# Altium project 4Z_PCB_2.PrjPcb
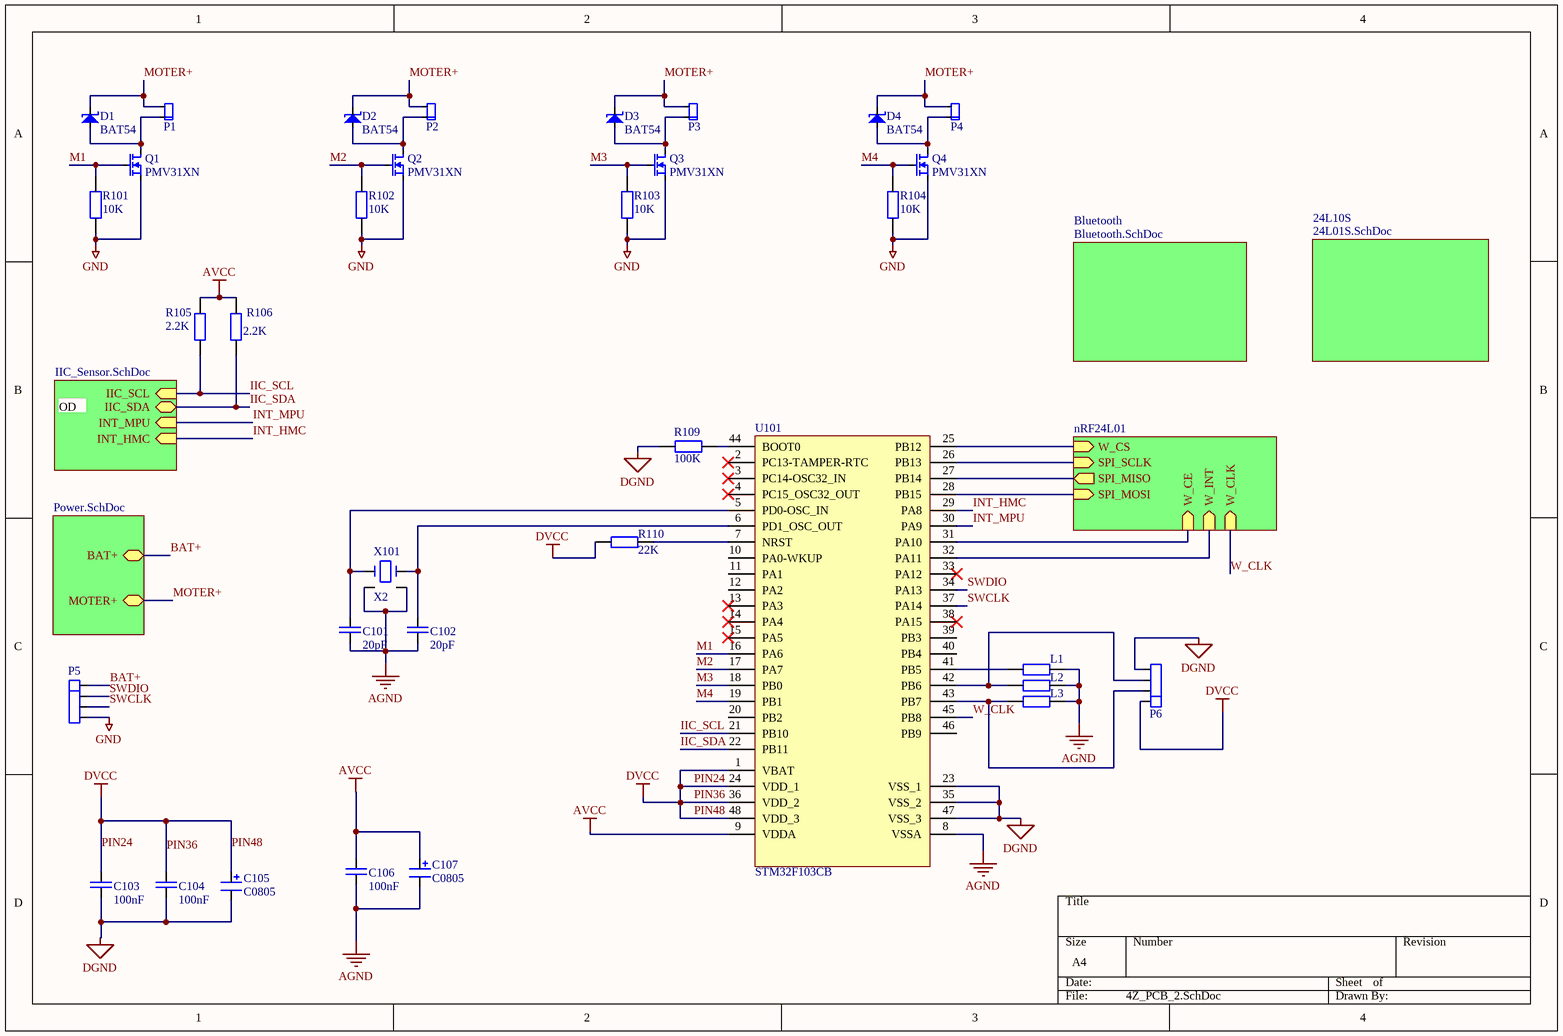
[diagram p0: 4Z_PCB_2.SchDoc]
3 sheets, 69 parts. Net scope: hierarchical (ports join the sheet entries above them; power ports are global).
Board file: 4Z_PCB_2.PcbDoc
Sheets:
  4Z_PCB_2.SchDoc
    Bluetooth = Bluetooth.SchDoc
    24L10S = 24L01S.SchDoc

## Sheet 4Z_PCB_2.SchDoc
size A4

### Parts
C101  20pF  [0603]
C102  20pF  [0603]
C103  100nF  [0603]
C104  100nF  [0603]
C105  C0805  [0805]
C106  100nF  [0603]
C107  C0805  [0805]
D1  BAT54  [BAT54]
D2  BAT54  [BAT54]
D3  BAT54  [BAT54]
D4  BAT54  [BAT54]
L1  (no value)  [0603]
L2  (no value)  [0603]
L3  (no value)  [0603]
P1  DIP_2  [DIP_2]  (value not drawn)
P2  DIP_2  [DIP_2]  (value not drawn)
P3  DIP_2  [DIP_2]  (value not drawn)
P4  DIP_2  [DIP_2]  (value not drawn)
P5  DIP_4  [DIP_4]  (value not drawn)
P6  (no value)  [DIP_4]
Q1  PMV31XN  [SOT23-TO236AB]
Q2  PMV31XN  [SOT23-TO236AB]
Q3  PMV31XN  [SOT23-TO236AB]
Q4  PMV31XN  [SOT23-TO236AB]
R101  10K  [0603]
R102  10K  [0603]
R103  10K  [0603]
R104  10K  [0603]
R105  2.2K  [0603]
R106  2.2K  [0603]
R109  100K  [0603]
R110  22K  [0603]
U101  STM32F103CB  [LQFP48]
X101  X2  [3225]

### Sub-sheets
24L10S = 24L01S.SchDoc: no entries
Bluetooth = Bluetooth.SchDoc: no entries
IIC_Sensor = IIC_Sensor.SchDoc (file not in this document): IIC_SCL (in), IIC_SDA (bidir), INT_MPU (in), INT_HMC (in)
nRF24L01 = nRF24L01 (file not in this document): W_CE (in), W_CS (in), W_CLK (in), SPI_SCLK (in), SPI_MOSI (in), SPI_MISO (out), W_INT (in)
Power = Power.SchDoc (file not in this document): BAT+, MOTER+

### Nets
AGND: C101.1 C102.1 C106.1 C107.2 L1.1 L2.1 L3.1 U101.8(VSSA) X101.2 X101.4
AVCC: C106.2 C107.1 R105.1 R106.1 U101.9(VDDA)
DGND: C103.1 C104.1 C105.2 P6.4 R109.2 U101.23(VSS_1) U101.35(VSS_2) U101.47(VSS_3)
GND: P5.4 Q1.2 Q2.2 Q3.2 Q4.2 R101.2 R102.2 R103.2 R104.2
PIN24: C103.2 C104.2 C105.1 P6.1 R110.2 U101.1(VBAT) U101.24(VDD_1) U101.36(VDD_2) U101.48(VDD_3)  [also labelled DVCC, PIN36, PIN48]
BAT+: P5.1 ; sheet Power/BAT+
IIC_SCL: R105.2 U101.21(PB10) ; sheet IIC_Sensor/IIC_SCL
IIC_SDA: R106.2 U101.22(PB11) ; sheet IIC_Sensor/IIC_SDA
INT_HMC: U101.29(PA8) ; sheet IIC_Sensor/INT_HMC
INT_MPU: U101.30(PA9) ; sheet IIC_Sensor/INT_MPU
M1: Q1.1 R101.1 U101.16(PA6)
M2: Q2.1 R102.1 U101.17(PA7)
M3: Q3.1 R103.1 U101.18(PB0)
M4: Q4.1 R104.1 U101.19(PB1)
MOTER+: D1.3 D2.3 D3.3 D4.3 P1.2 P2.2 P3.2 P4.2 ; sheet Power/MOTER+
SWCLK: P5.3 U101.37(PA14)
SWDIO: P5.2 U101.34(PA13)
W_CLK: U101.45(PB8) ; sheet nRF24L01/W_CLK
NetC101_2: C101.2 U101.5(PD0-OSC_IN) X101.1
NetC102_2: C102.2 U101.6(PD1_OSC_OUT) X101.3
NetD1_1: D1.1 P1.1 Q1.3
NetD2_1: D2.1 P2.1 Q2.3
NetD3_1: D3.1 P3.1 Q3.3
NetD4_1: D4.1 P4.1 Q4.3
NetL1_2: L1.2 U101.41(PB5)
NetL2_2: L2.2 P6.3 U101.42(PB6)
NetL3_2: L3.2 P6.2 U101.43(PB7)
NetR109_1: R109.1 U101.44(BOOT0)
NetR110_1: R110.1 U101.7(NRST)
NetU101_25: U101.25(PB12) ; sheet nRF24L01/W_CS
NetU101_26: U101.26(PB13) ; sheet nRF24L01/SPI_SCLK
NetU101_27: U101.27(PB14) ; sheet nRF24L01/SPI_MISO
NetU101_28: U101.28(PB15) ; sheet nRF24L01/SPI_MOSI
NetU101_31: U101.31(PA10) ; sheet nRF24L01/W_CE
NetU101_32: U101.32(PA11) ; sheet nRF24L01/W_INT

Not connected (* = marked no-connect by the designer): U101 2(PC13-TAMPER-RTC)* 3(PC14-OSC32_IN)* 4(PC15_OSC32_OUT)* 10(PA0-WKUP) 11(PA1) 12(PA2) 13(PA3)* 14(PA4)* 15(PA5)* 20(PB2) 33(PA12)* 38(PA15)* 39(PB3) 40(PB4) 46(PB9)

### Notes on the sheet
- OD

### Library data of the parts
C101-C104 C106 = C0603
L1-L3 R101-R106 R109 R110 = R0603
P6 = DIP_4
X101 = X2: 3225

## Sheet Bluetooth.SchDoc
size A4
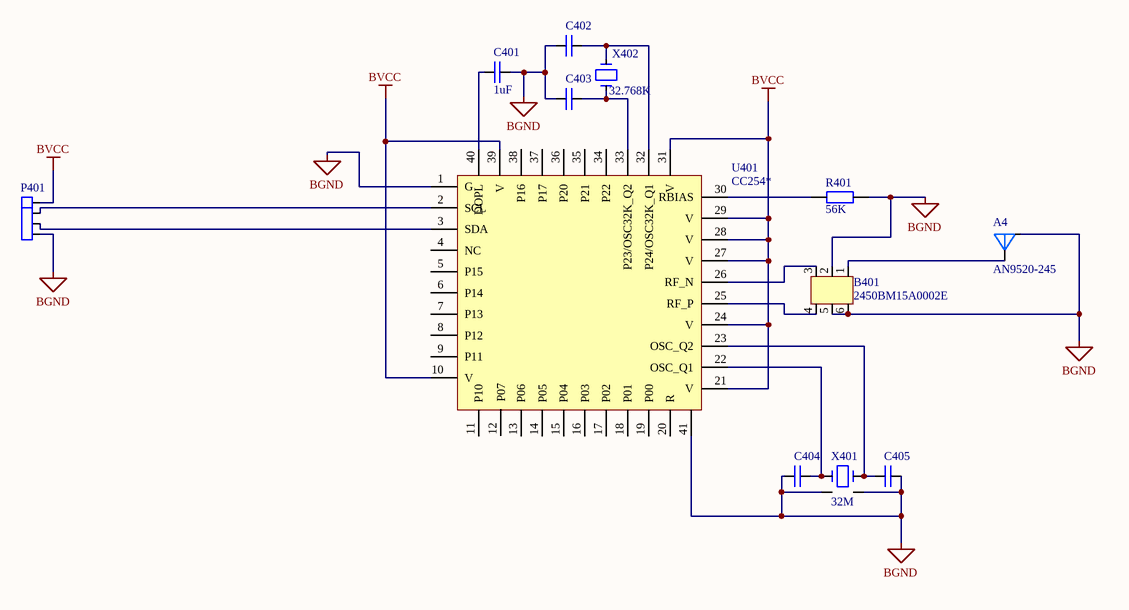
[diagram p1: Bluetooth.SchDoc]

### Parts
A4  AN9520-245  [AN9520-245]
B401  2450BM15A0002E  [2450BM15A0002]
C401  1uF  [0603]
C402  (no value)  [0603]
C403  (no value)  [0603]
C404  (no value)  [0603]
C405  (no value)  [0603]
P401  DIP_4  [DIP_4]  (value not drawn)
R401  56K  [0603]
U401  CC254*  [CC254x]
X401  32M  [3225]
X402  32.768K  [3215]

### Nets
BGND: A4.2 B401.2 B401.5 B401.6 C401.2 C402.1 C403.1 C404.1 C405.2 P401.4 R401.1 U401.1(G) U401.41 X401.2 X401.4
BVCC: P401.1 U401.10(V) U401.21(V) U401.24(V) U401.27(V) U401.28(V) U401.29(V) U401.31(V) U401.39(V)
NetA4_1: A4.1 B401.1
NetB401_3: B401.3 U401.26(RF_N)
NetB401_4: B401.4 U401.25(RF_P)
NetC401_1: C401.1 U401.40(DOPL)
NetC402_2: C402.2 U401.32(P24/OSC32K_Q1) X402.2
NetC403_2: C403.2 U401.33(P23/OSC32K_Q2) X402.1
NetC404_2: C404.2 U401.22(OSC_Q1) X401.1
NetC405_1: C405.1 U401.23(OSC_Q2) X401.3
NetP401_2: P401.2 U401.2(SCL)
NetP401_3: P401.3 U401.3(SDA)
NetR401_2: R401.2 U401.30(RBIAS)

Not connected (* = marked no-connect by the designer): U401 4(NC) 5(P15) 6(P14) 7(P13) 8(P12) 9(P11) 11(P10) 12(P07) 13(P06) 14(P05) 15(P04) 16(P03) 17(P02) 18(P01) 19(P00) 20(R) 34(P22) 35(P21) 36(P20) 37(P17) 38(P16)

### Library data of the parts
A4 = AN9520-245: antenna
B401 = 2450BM15A0002E: CC2541
C401-C405 = C0603
R401 = R0603
U401 = CC254x
X401 = X2: 3225
X402 = X3: 3215

## Sheet 24L01S.SchDoc
size A4
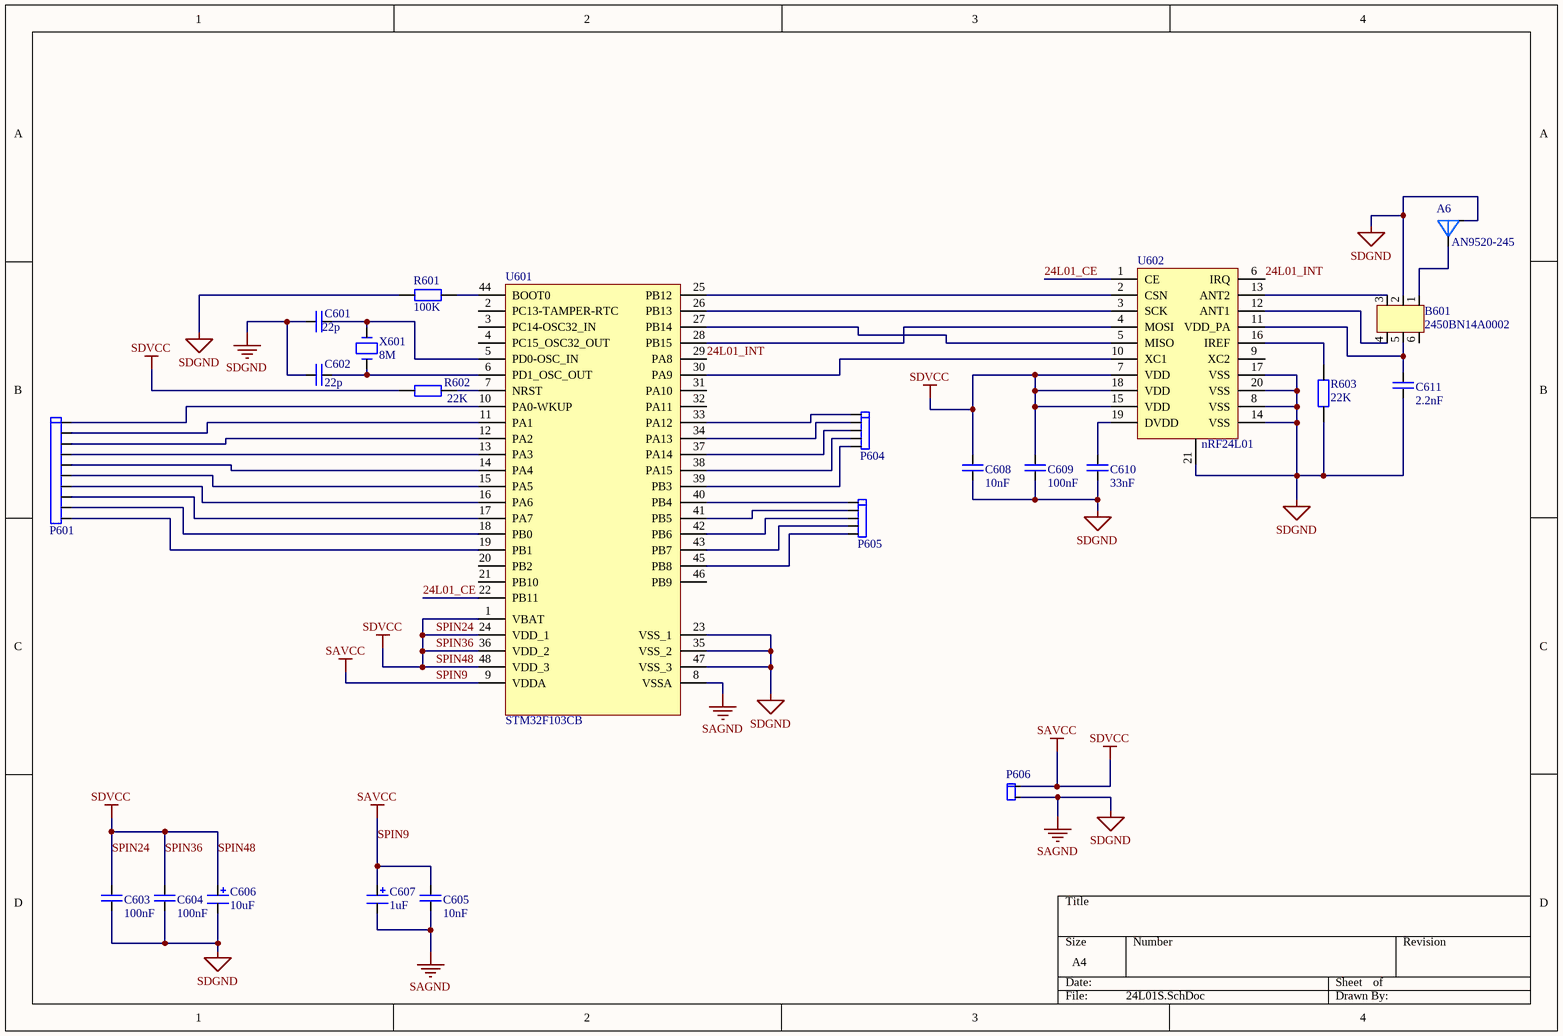
[diagram p2: 24L01S.SchDoc]

### Parts
A6  AN9520-245  [AN9520-245]
B601  2450BN14A0002  [2450BM14A0002]
C601  22p  [0603]
C602  22p  [0603]
C603  100nF  [0603]
C604  100nF  [0603]
C605  10nF  [0603]
C606  10uF  [0805]
C607  1uF  [0805]
C608  10nF  [0603]
C609  100nF  [0603]
C610  33nF  [0603]
C611  2.2nF  [0603]
P601  DIP10_1.27mm  [DIP10_1.27mm]  (value not drawn)
P604  DIP_5_1.27mm  [DIP_5_1.27mm]  (value not drawn)
P605  DIP_5_1.27mm  [DIP_5_1.27mm]  (value not drawn)
P606  DIP_2  [DIP_2]  (value not drawn)
R601  100K  [0603]
R602  22K  [0603]
R603  22K  [0603]
U601  STM32F103CB  [LQFP48]
U602  nRF24L01  [nRF24L01]
X601  8M  [X1]

### Nets
SAGND: A6.2 B601.2 C601.1 C602.1 C603.1 C604.1 C605.1 C606.2 C607.2 C608.1 C609.1 C610.1 C611.1 P606.2 R601.1 R603.2 U601.8(VSSA) U601.23(VSS_1) U601.35(VSS_2) U601.47(VSS_3) U602.8(VSS) U602.14(VSS) U602.17(VSS) U602.20(VSS) U602.21  [also labelled SDGND]
SPIN24: C603.2 C604.2 C605.2 C606.1 C607.1 C608.2 C609.2 P606.1 R602.2 U601.1(VBAT) U601.9(VDDA) U601.24(VDD_1) U601.36(VDD_2) U601.48(VDD_3) U602.7(VDD) U602.15(VDD) U602.18(VDD)  [also labelled SAVCC, SDVCC, SPIN36, SPIN48, SPIN9]
24L01_CE: U601.22(PB11) U602.1(CE)
24L01_INT: U601.29(PA8) U602.6(IRQ)
NetA6_1: A6.1 B601.1
NetB601_3: B601.3 U602.13(ANT2)
NetB601_4: B601.4 U602.12(ANT1)
NetB601_5: B601.5 C611.2 U602.11(VDD_PA)
NetC601_2: C601.2 U601.5(PD0-OSC_IN) X601.2
NetC602_2: C602.2 U601.6(PD1_OSC_OUT) X601.1
NetC610_2: C610.2 U602.19(DVDD)
NetP601_1: P601.1 U601.10(PA0-WKUP)
NetP601_2: P601.2 U601.11(PA1)
NetP601_3: P601.3 U601.12(PA2)
NetP601_4: P601.4 U601.13(PA3)
NetP601_5: P601.5 U601.14(PA4)
NetP601_6: P601.6 U601.15(PA5)
NetP601_7: P601.7 U601.16(PA6)
NetP601_8: P601.8 U601.17(PA7)
NetP601_9: P601.9 U601.18(PB0)
NetP601_10: P601.10 U601.19(PB1)
NetP604_1: P604.1 U601.33(PA12)
NetP604_2: P604.2 U601.34(PA13)
NetP604_3: P604.3 U601.37(PA14)
NetP604_4: P604.4 U601.38(PA15)
NetP604_5: P604.5 U601.39(PB3)
NetP605_1: P605.1 U601.40(PB4)
NetP605_2: P605.2 U601.41(PB5)
NetP605_3: P605.3 U601.42(PB6)
NetP605_4: P605.4 U601.43(PB7)
NetP605_5: P605.5 U601.45(PB8)
NetR601_2: R601.2 U601.44(BOOT0)
NetR602_1: R602.1 U601.7(NRST)
NetR603_1: R603.1 U602.16(IREF)
NetU601_25: U601.25(PB12) U602.2(CSN)
NetU601_26: U601.26(PB13) U602.3(SCK)
NetU601_27: U601.27(PB14) U602.5(MISO)
NetU601_28: U601.28(PB15) U602.4(MOSI)
NetU601_30: U601.30(PA9) U602.10(XC1)

Not connected (* = marked no-connect by the designer): B601 6; U601 2(PC13-TAMPER-RTC) 3(PC14-OSC32_IN) 4(PC15_OSC32_OUT) 20(PB2) 21(PB10) 31(PA10) 32(PA11) 46(PB9); U602 9(XC2)

### Library data of the parts
A6 = AN9520-245: antenna
B601 = 2450BN14A0002: nRF24L01
C601-C605 C608-C611 = C0603
C606 C607 = C0805
R601-R603 = R0603
X601 = X1